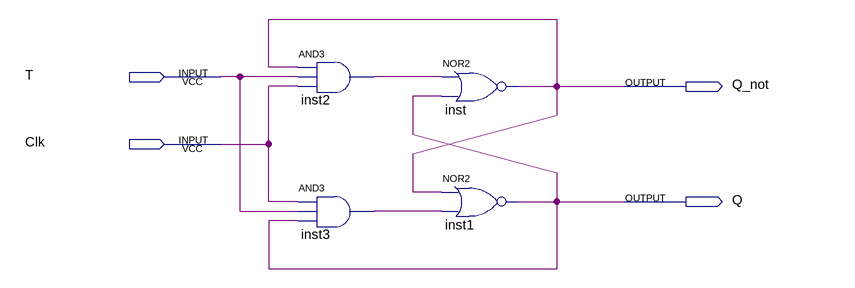
[diagram p0: schematic sheet]
// Quartus schematic T_FlipFlop.bdf as structural Verilog: 4 symbols, 4 pins
module T_FlipFlop (
  input  T,
  input  Clk,
  output Q_not,
  output Q
);

  wire inst2_out, inst3_out;

  and inst2 (inst2_out, Q_not, T, Clk);
  and inst3 (inst3_out, Clk, T, Q);
  nor inst (Q_not, inst2_out, Q);
  nor inst1 (Q, Q_not, inst3_out);
endmodule
